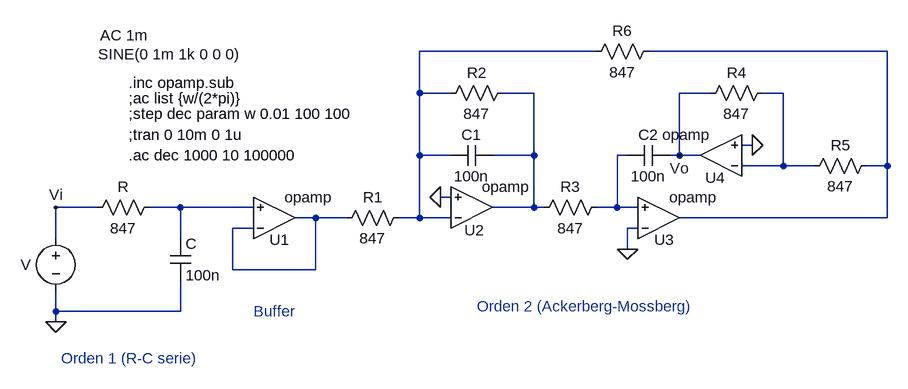
[diagram p0: schematic TS3_ackmoss.asc]
TS3_ackmoss.asc, the LTspice schematic file:
Version 4
SHEET 1 1324 904
WIRE 512 112 240 112
WIRE 960 112 592 112
WIRE 240 176 240 112
WIRE 288 176 240 176
WIRE 416 176 368 176
WIRE 688 176 640 176
WIRE 800 176 768 176
WIRE 752 256 736 256
WIRE 240 272 240 176
WIRE 288 272 240 272
WIRE 416 272 416 176
WIRE 416 272 352 272
WIRE 560 272 544 272
WIRE 640 272 640 176
WIRE 640 272 624 272
WIRE 672 272 640 272
WIRE 800 288 800 176
WIRE 800 288 736 288
WIRE 848 288 800 288
WIRE 960 288 960 112
WIRE 960 288 928 288
WIRE 288 336 272 336
WIRE -256 352 -320 352
WIRE -128 352 -176 352
WIRE -16 352 -128 352
WIRE 416 352 416 272
WIRE 416 352 352 352
WIRE 432 352 416 352
WIRE 544 352 544 272
WIRE 544 352 512 352
WIRE 576 352 544 352
WIRE 80 368 48 368
WIRE 128 368 80 368
WIRE 240 368 240 272
WIRE 240 368 208 368
WIRE 288 368 240 368
WIRE 960 368 960 288
WIRE 960 368 640 368
WIRE -16 384 -48 384
WIRE 576 384 560 384
WIRE -320 400 -320 352
WIRE -128 400 -128 352
WIRE 560 416 560 384
WIRE -48 448 -48 384
WIRE 80 448 80 368
WIRE 80 448 -48 448
WIRE -320 512 -320 480
WIRE -128 512 -128 464
WIRE -128 512 -320 512
WIRE -320 528 -320 512
FLAG -320 352 Vi
FLAG 272 336 0
FLAG 560 416 0
FLAG 752 256 0
FLAG 640 272 Vo
FLAG -320 528 0
SYMBOL voltage -320 384 R0
WINDOW 123 68 -297 Left 2
WINDOW 39 0 0 Left 2
WINDOW 0 -54 56 Left 2
WINDOW 3 65 -268 Left 2
SYMATTR Value2 AC 1m
SYMATTR InstName V
SYMATTR Value SINE(0 1m 1k 0 0 0)
SYMBOL res 224 352 R90
WINDOW 0 0 56 VBottom 2
WINDOW 3 32 56 VTop 2
SYMATTR InstName R1
SYMATTR Value 847
SYMBOL res 528 336 R90
WINDOW 0 0 56 VBottom 2
WINDOW 3 32 56 VTop 2
SYMATTR InstName R3
SYMATTR Value 847
SYMBOL cap 352 256 R90
WINDOW 0 0 32 VBottom 2
WINDOW 3 32 32 VTop 2
SYMATTR InstName C1
SYMATTR Value 100n
SYMBOL Opamps\\opamp 320 416 M180
WINDOW 0 20 29 Right 2
SYMATTR InstName U2
SYMBOL Opamps\\opamp 608 432 M180
WINDOW 0 24 30 Right 2
SYMATTR InstName U3
SYMBOL res 784 160 R90
WINDOW 0 0 56 VBottom 2
WINDOW 3 32 56 VTop 2
SYMATTR InstName R4
SYMATTR Value 847
SYMBOL cap 624 256 R90
WINDOW 0 0 32 VBottom 2
WINDOW 3 32 32 VTop 2
SYMATTR InstName C2
SYMATTR Value 100n
SYMBOL res 384 160 R90
WINDOW 0 0 56 VBottom 2
WINDOW 3 32 56 VTop 2
SYMATTR InstName R2
SYMATTR Value 847
SYMBOL Opamps\\opamp 704 336 R180
WINDOW 0 24 30 Right 2
SYMATTR InstName U4
SYMBOL res 944 272 R90
WINDOW 0 0 56 VBottom 2
WINDOW 3 32 56 VTop 2
SYMATTR InstName R5
SYMATTR Value 847
SYMBOL res 608 96 R90
WINDOW 0 0 56 VBottom 2
WINDOW 3 32 56 VTop 2
SYMATTR InstName R6
SYMATTR Value 847
SYMBOL res -160 336 R90
WINDOW 0 0 56 VBottom 2
WINDOW 3 32 56 VTop 2
SYMATTR InstName R
SYMATTR Value 847
SYMBOL cap -144 400 R0
SYMATTR InstName C
SYMATTR Value 100n
SYMBOL Opamps\\opamp 16 432 M180
WINDOW 0 24 30 Right 2
SYMATTR InstName U1
TEXT -208 240 Left 2 !;tran 0 10m 0 1u
TEXT -208 272 Left 2 !.ac dec 1000 10 100000
TEXT -208 208 Left 2 !;step dec param w 0.01 100 100
TEXT -208 184 Left 2 !;ac list {w/(2*pi)}
TEXT -208 160 Left 2 !.inc opamp.sub
TEXT 328 504 Left 2 ;Orden 2 (Ackerberg-Mossberg)
TEXT -312 584 Left 2 ;Orden 1 (R-C serie)
TEXT -16 512 Left 2 ;Buffer

The netlist it stands for:
* TS3_ackmoss.asc
V Vi 0 SINE(0 1m 1k 0 0 0) AC 1m
R1 N001 N007 847
R3 N005 N003 847
C1 N003 N001 100n
XU2 N001 0 N003 opamp Aol=100K GBW=10Meg  ; pins invin noninvin out
XU3 0 N005 N002 opamp Aol=100K GBW=10Meg  ; pins invin noninvin out
R4 N004 Vo 847
C2 Vo N005 100n
R2 N003 N001 847
XU4 N004 0 Vo opamp Aol=100K GBW=10Meg  ; pins invin noninvin out
R5 N002 N004 847
R6 N002 N001 847
R N006 Vi 847
C N006 0 100n
XU1 N007 N006 N007 opamp Aol=100K GBW=10Meg  ; pins invin noninvin out
;tran 0 10m 0 1u
.ac dec 1000 10 100000
;step dec param w 0.01 100 100
;ac list {w/(2*pi)}
.inc opamp.sub
* Orden 2 (Ackerberg-Mossberg)
* Orden 1 (R-C serie)
* Buffer
.backanno
.end

* Results of the author's LTspice run, read from the files saved beside the schematic
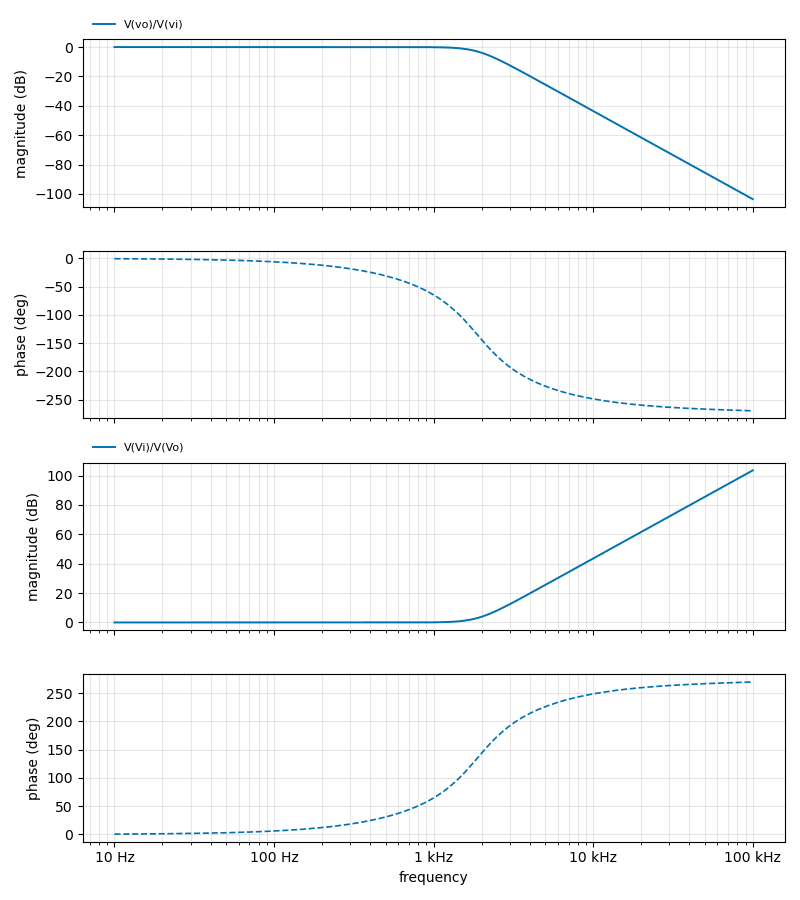
[diagram p1: AC Analysis of TS3_ackmoss.asc, plotted from the saved traces]
* AC Analysis, 1 run:
*   V(vo)/V(vi): -0.00 dB at 10 Hz, -103.57 dB at 100 kHz, peak -0.00 dB at 230.1 Hz, 3 dB below the peak at 1.879 kHz
*   V(Vi)/V(Vo): 0.00 dB at 10 Hz, 103.57 dB at 100 kHz, peak 103.57 dB at 100 kHz, 3 dB below the peak at 89.09 kHz